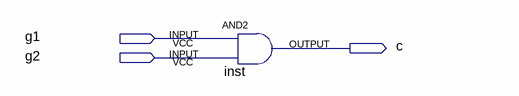
[diagram p0: schematic sheet]
// Quartus schematic and_prc.bdf as structural Verilog: 1 symbols, 3 pins
module and_prc (
  input  g1,
  input  g2,
  output c
);

  // AND2 inst has open pins: IN1=g1, IN2=g2, OUT=open
endmodule
